# Altium schematic sheet E49400T20S.SchDoc
size A; SheetNumber: 3; SheetTotal: 3
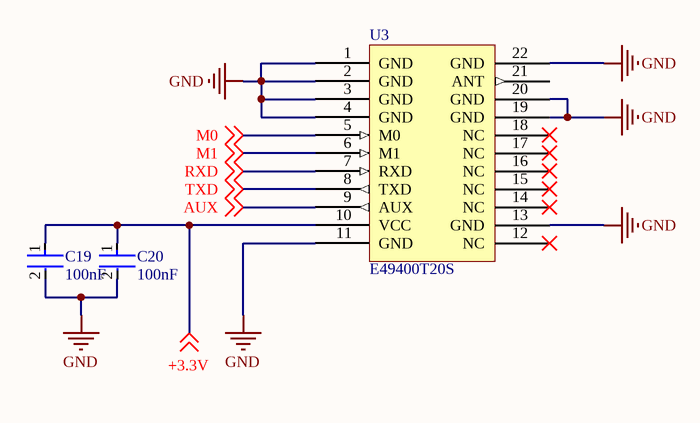
[diagram p0: E49400T20S.SchDoc]

## Parts
C19  100nF  [FP-CGA3E-0_3-0_1-IPC_A]
C20  100nF  [FP-CGA3E-0_3-0_1-IPC_A]
U3  E49400T20S  [PCBComponent_1]

## Nets
GND: C19.2 C20.2 U3.1(GND) U3.2(GND) U3.3(GND) U3.4(GND) U3.11(GND) U3.13(GND) U3.19(GND) U3.20(GND) U3.22(GND)
+3.3V: C19.1 C20.1 U3.10(VCC) ; off-sheet +3.3V
AUX: U3.9(AUX) ; off-sheet AUX
M0: U3.5(M0) ; off-sheet M0
M1: U3.6(M1) ; off-sheet M1
RXD: U3.7(RXD) ; off-sheet RXD
TXD: U3.8(TXD) ; off-sheet TXD

Not connected (* = marked no-connect by the designer): U3 12(NC)* 14(NC)* 15(NC)* 16(NC)* 17(NC)* 18(NC)* 21(ANT)

## Library data of the parts
C19 C20 = CMP-2000-07546-2: Cap Ceramic 100nF 50V X7R 10% Pad SMD 0603 +125°C Automotive T/R; Weight: 7.1E-05oz; Composition: Ceramic; Max Operating Temperature: 125°C; Termination: SMD/SMT; Dielectric: X7R; Length: 1.6mm; Package Quantity: 1; REACH SVHC: No SVHC; Lead Free: Lead Free; Case Code (Metric): 1608; Min Operating Temperature: -55°C; Packaging: Tape and Reel; Tolerance: 10%; Voltage Rating: 50V; Case Code (Imperial): 0603; Capacitance: 100nF; Case/Package: 0603; Voltage Rating (DC): 50V; Depth: 0.8mm; Radiation Hardening: No; Ratings: AEC-Q200; Mount: Surface Mount; Voltage: 50V; Thickness: 0.035inch; Width: 0.8mm; Height: 0.8mm
U3 = Component_1